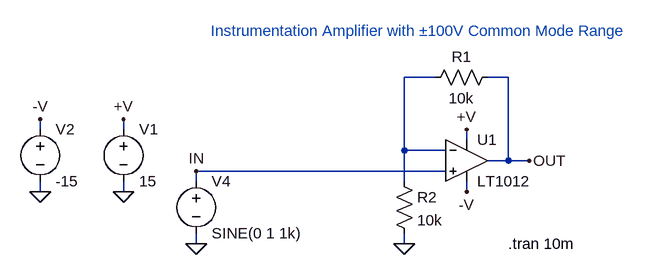
[diagram p0: schematic ex1.asc]
ex1.asc, the LTspice schematic file:
Version 4
SHEET 1 896 680
WIRE 144 112 96 112
WIRE 256 112 224 112
WIRE -464 192 -464 176
WIRE -336 192 -336 176
WIRE 192 208 192 192
WIRE 96 224 96 112
WIRE 160 224 96 224
WIRE 256 240 256 112
WIRE 256 240 224 240
WIRE 288 240 256 240
WIRE 160 256 -224 256
WIRE -224 272 -224 256
WIRE 96 272 96 224
WIRE -464 288 -464 272
WIRE -336 288 -336 272
WIRE 192 288 192 272
WIRE -224 368 -224 352
WIRE 96 368 96 352
FLAG -336 288 0
FLAG 192 192 +V
FLAG -336 176 +V
FLAG 192 288 -V
FLAG -464 288 0
FLAG -464 176 -V
FLAG -224 368 0
FLAG 96 368 0
FLAG -224 256 IN
FLAG 288 240 OUT
SYMBOL voltage -336 176 R0
SYMATTR InstName V1
SYMATTR Value 15
SYMBOL voltage -464 176 R0
SYMATTR InstName V2
SYMATTR Value -15
SYMBOL res 240 96 R90
WINDOW 0 0 56 VBottom 2
WINDOW 3 32 56 VTop 2
SYMATTR InstName R1
SYMATTR Value 10k
SYMBOL opamps\\LT1012 192 176 R0
SYMATTR InstName U1
SYMBOL res 80 256 R0
SYMATTR InstName R2
SYMATTR Value 10k
SYMBOL voltage -224 256 R0
WINDOW 123 0 0 Left 2
WINDOW 39 0 0 Left 2
SYMATTR InstName V4
SYMATTR Value SINE(0 1 1k)
TEXT 120 56 Bottom 2 ;Instrumentation Amplifier with ±100V Common Mode Range
TEXT 256 368 Left 2 !.tran 10m

The netlist it stands for:
* ex1.asc
V1 +V 0 15
V2 -V 0 -15
R1 OUT N001 10k
XU1 IN N001 +V -V OUT LT1012  ; pins In+ In- V+ V- OUT
R2 N001 0 10k
V4 IN 0 SINE(0 1 1k)
* Instrumentation Amplifier with ±100V Common Mode Range
.tran 10m
.backanno
.end

* Results of the author's LTspice run, read from the files saved beside the schematic
* Operating Point, zero values left out:
*   V(+v) = 15 V
*   V(-v) = -15 V
*   I(V2) = 380 µA
*   I(V1) = -380 µA
*   Ix(u1:3) = 380 µA
*   Ix(u1:4) = -380 µA
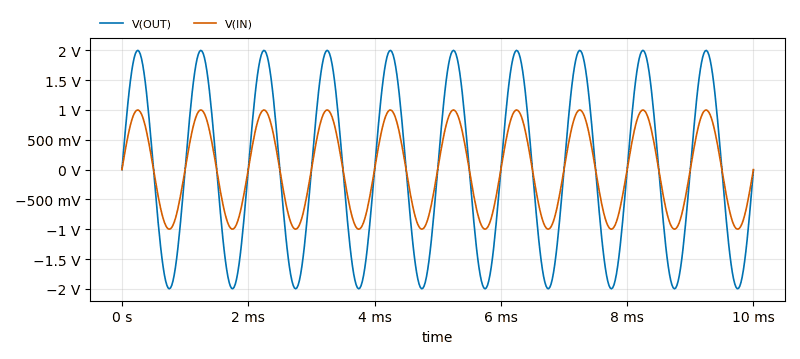
[diagram p1: Transient Analysis of ex1.asc, plotted from the saved traces]
* Transient Analysis, 1 run:
*   V(OUT): min -1.998 V, max 1.998 V, average -1.467 µV, rms 1.413 V, last -6.912 mV
*   V(IN): min -999.1 mV, max 999.1 mV, average -971 nV, rms 706.5 mV, last 0 V